# EAGLE design PGTNXEN_cv_out (EAGLE 8.5.2)
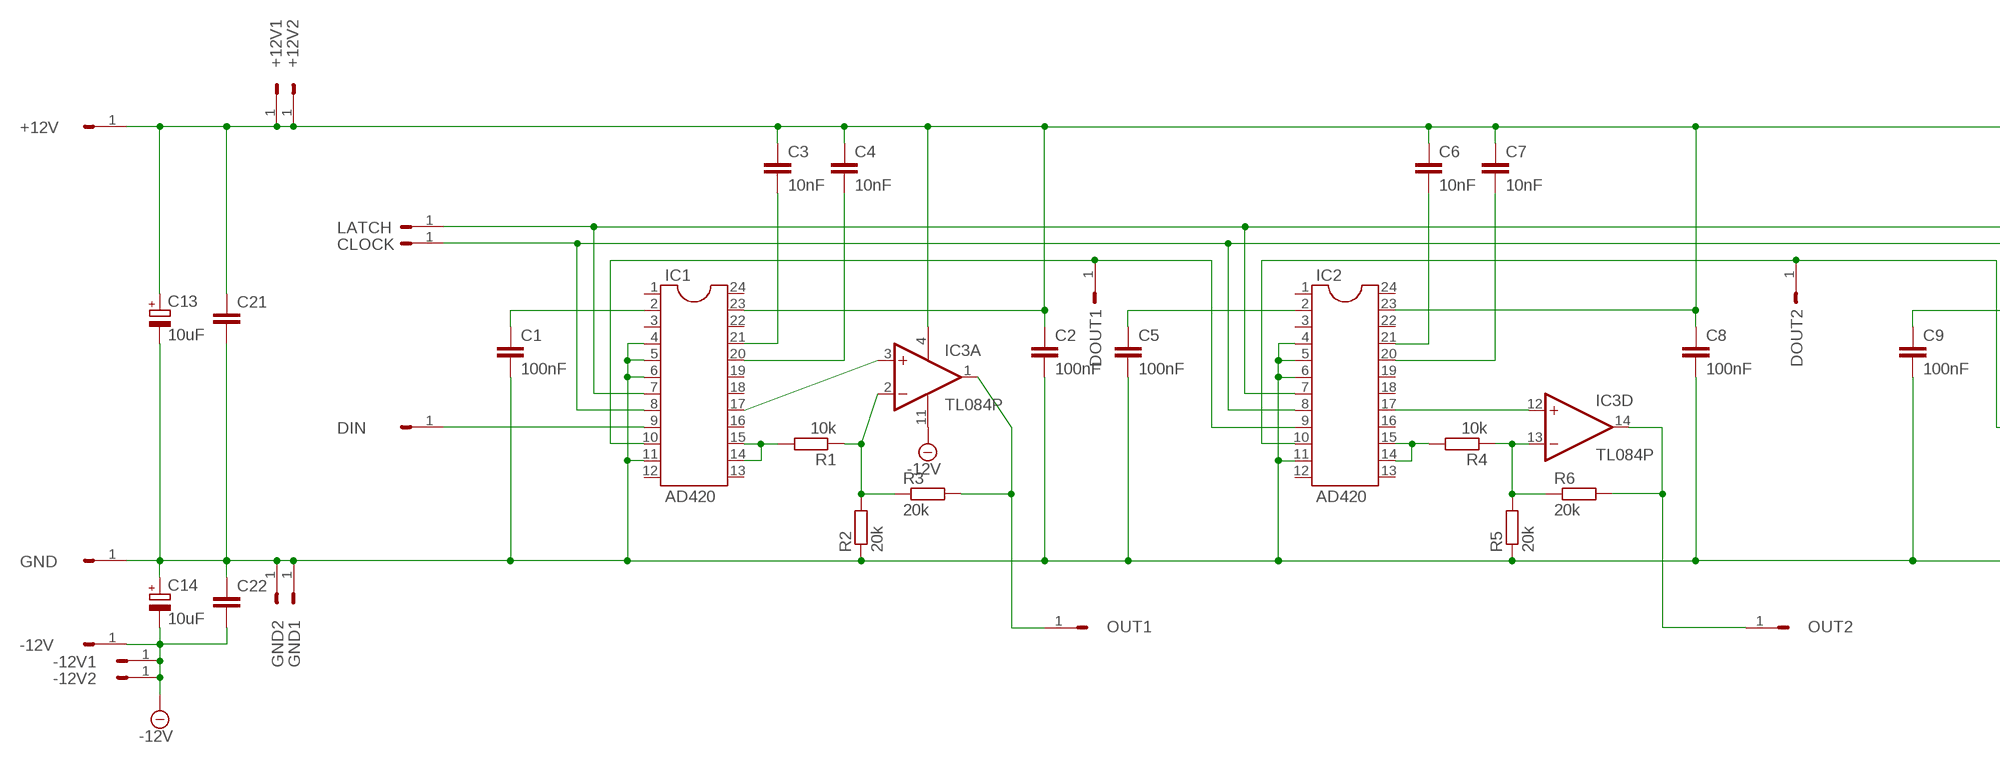
[diagram p0: schematic, sheet 1, part 1 of 2]
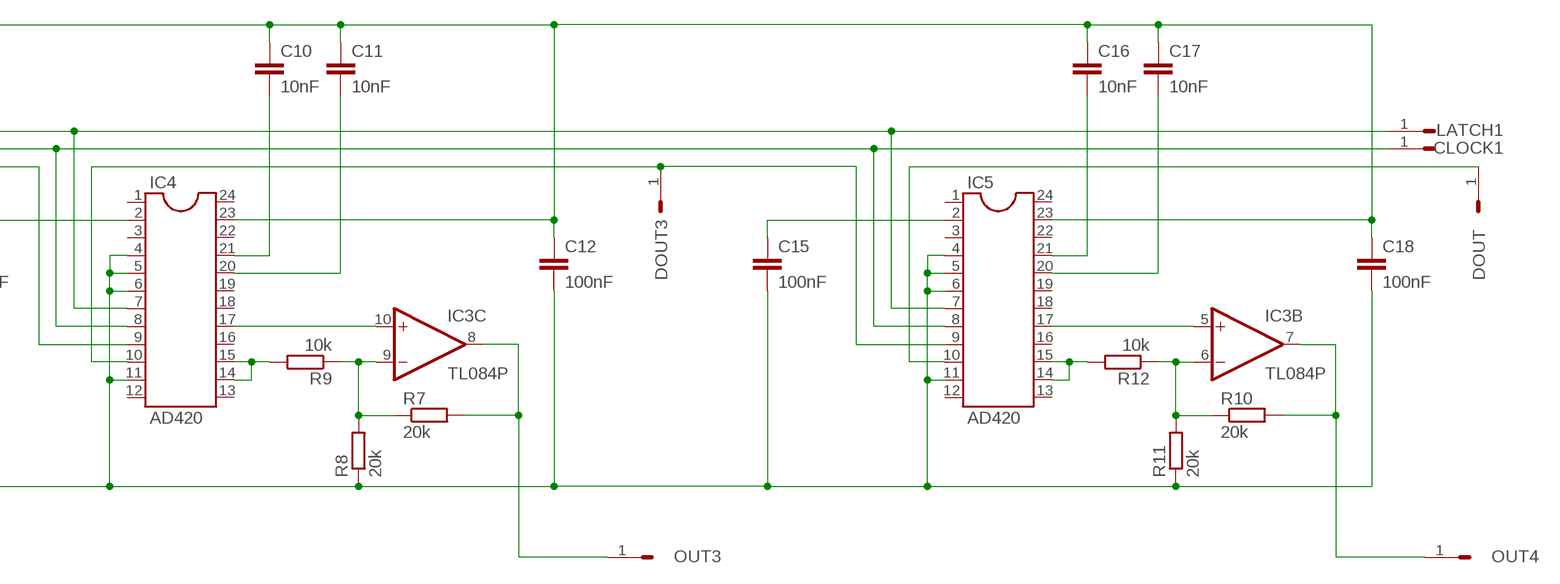
[diagram p1: schematic, sheet 1, part 2 of 2]

## Parts
+12V  HEADER/MALE/01  [HEADER/MALE/01]
+12V1  HEADER/MALE/01  [HEADER/MALE/01]
+12V2  HEADER/MALE/01  [HEADER/MALE/01]
-12V  HEADER/MALE/01  [HEADER/MALE/01]
-12V1  HEADER/MALE/01  [HEADER/MALE/01]
-12V2  HEADER/MALE/01  [HEADER/MALE/01]
C1  100nF  CAPACITORCERAMICDISC/5  [CERAMICDISC/5]
C2  100nF  CAPACITORCERAMICDISC/5  [CERAMICDISC/5]
C3  10nF  CAPACITORCERAMICDISC/5  [CERAMICDISC/5]
C4  10nF  CAPACITORCERAMICDISC/5  [CERAMICDISC/5]
C5  100nF  CAPACITORCERAMICDISC/5  [CERAMICDISC/5]
C6  10nF  CAPACITORCERAMICDISC/5  [CERAMICDISC/5]
C7  10nF  CAPACITORCERAMICDISC/5  [CERAMICDISC/5]
C8  100nF  CAPACITORCERAMICDISC/5  [CERAMICDISC/5]
C9  100nF  CAPACITORCERAMICDISC/5  [CERAMICDISC/5]
C10  10nF  CAPACITORCERAMICDISC/5  [CERAMICDISC/5]
C11  10nF  CAPACITORCERAMICDISC/5  [CERAMICDISC/5]
C12  100nF  CAPACITORCERAMICDISC/5  [CERAMICDISC/5]
C13  10uF  CAPACITOR/POLARIZEDE2.5-6  [E2,5-6]
C14  10uF  CAPACITOR/POLARIZEDE2.5-6  [E2,5-6]
C15  100nF  CAPACITORCERAMICDISC/5  [CERAMICDISC/5]
C16  10nF  CAPACITORCERAMICDISC/5  [CERAMICDISC/5]
C17  10nF  CAPACITORCERAMICDISC/5  [CERAMICDISC/5]
C18  100nF  CAPACITORCERAMICDISC/5  [CERAMICDISC/5]
C21  CAPACITORCERAMICDISC/5  [CERAMICDISC/5]
C22  CAPACITORCERAMICDISC/5  [CERAMICDISC/5]
CLOCK  HEADER/MALE/01  [HEADER/MALE/01]
CLOCK1  HEADER/MALE/01  [HEADER/MALE/01]
DIN  HEADER/MALE/01  [HEADER/MALE/01]
DOUT  HEADER/MALE/01  [HEADER/MALE/01]
DOUT1  HEADER/MALE/01  [HEADER/MALE/01]
DOUT2  HEADER/MALE/01  [HEADER/MALE/01]
DOUT3  HEADER/MALE/01  [HEADER/MALE/01]
GND  HEADER/MALE/01  [HEADER/MALE/01]
GND1  HEADER/MALE/01  [HEADER/MALE/01]
GND2  HEADER/MALE/01  [HEADER/MALE/01]
IC1  AD420  DIL24-3  [DIL24-3]
IC2  AD420  DIL24-3  [DIL24-3]
IC3  TL084P  [DIL14]
IC4  AD420  DIL24-3  [DIL24-3]
IC5  AD420  DIL24-3  [DIL24-3]
LATCH  HEADER/MALE/01  [HEADER/MALE/01]
LATCH1  HEADER/MALE/01  [HEADER/MALE/01]
OUT1  HEADER/MALE/01  [HEADER/MALE/01]
OUT2  HEADER/MALE/01  [HEADER/MALE/01]
OUT3  HEADER/MALE/01  [HEADER/MALE/01]
OUT4  HEADER/MALE/01  [HEADER/MALE/01]
R1  10k  R-EU_0204/7  [0204/7]
R2  20k  R-EU_0204/7  [0204/7]
R3  20k  R-EU_0204/7  [0204/7]
R4  10k  R-EU_0204/7  [0204/7]
R5  20k  R-EU_0204/7  [0204/7]
R6  20k  R-EU_0204/7  [0204/7]
R7  20k  R-EU_0204/7  [0204/7]
R8  20k  R-EU_0204/7  [0204/7]
R9  10k  R-EU_0204/7  [0204/7]
R10  20k  R-EU_0204/7  [0204/7]
R11  20k  R-EU_0204/7  [0204/7]
R12  10k  R-EU_0204/7  [0204/7]

## Nets
-12V: -12V1.1 -12V2.1 -12V.1 C14.- C22.2 IC3.11(P:V-)
GND: C1.2 C2.2 C5.2 C8.2 C9.2 C12.2 C13.- C14.+ C15.2 C18.2 C21.2 C22.1 GND1.1 GND2.1 GND.1 IC1.4 IC1.5 IC1.6 IC1.11 IC2.4 IC2.5 IC2.6 IC2.11 IC4.4 IC4.5 IC4.6 IC4.11 IC5.4 IC5.5 IC5.6 IC5.11 R2.1 R5.1 R8.1 R11.1
N$1: CLOCK1.1 CLOCK.1 IC1.8 IC2.8 IC4.8 IC5.8
N$2: IC2.17 IC3.12(D:+IN)
N$3: DIN.1 IC1.9
N$4: IC2.14 IC2.15 R4.2
N$5: DOUT.1 IC5.10
N$6: IC3.2(A:-IN) R1.1 R2.2 R3.1
N$7: +12V1.1 +12V2.1 +12V.1 C2.1 C3.1 C4.1 C6.1 C7.1 C8.1 C10.1 C11.1 C12.1 C13.+ C16.1 C17.1 C18.1 C21.1 IC1.23 IC2.23 IC3.4(P:V+) IC4.23 IC5.23
N$8: C1.1 IC1.2
N$9: C3.2 IC1.21
N$10: C4.2 IC1.20
N$11: IC1.17 IC3.3(A:+IN)
N$12: IC1.14 IC1.15 R1.2
N$13: IC3.1(A:OUT) OUT1.1 R3.2
N$14: IC3.5(B:+IN) IC5.17
N$15: DOUT1.1 IC1.10 IC2.9
N$17: IC3.14(D:OUT) OUT2.1 R6.2
N$19: C5.1 IC2.2
N$20: C6.2 IC2.21
N$21: C7.2 IC2.20
N$22: IC3.13(D:-IN) R4.1 R5.2 R6.1
N$23: DOUT3.1 IC4.10 IC5.9
N$24: DOUT2.1 IC2.10 IC4.9
N$25: IC4.14 IC4.15 R9.2
N$26: IC3.10(C:+IN) IC4.17
N$27: IC3.8(C:OUT) OUT3.1 R7.2
N$28: C9.1 IC4.2
N$29: C10.2 IC4.21
N$30: C11.2 IC4.20
N$32: IC5.14 IC5.15 R12.2
N$33: IC3.9(C:-IN) R7.1 R8.2 R9.1
N$35: IC3.7(B:OUT) OUT4.1 R10.2
N$36: C15.1 IC5.2
N$37: C16.2 IC5.21
N$38: C17.2 IC5.20
N$39: IC1.7 IC2.7 IC4.7 IC5.7 LATCH1.1 LATCH.1
N$40: IC3.6(B:-IN) R10.1 R11.2 R12.1
Unconnected: IC1.1 IC1.3 IC1.12 IC1.13 IC1.16 IC1.18 IC1.19 IC1.22 IC1.24 IC2.1 IC2.3 IC2.12 IC2.13 IC2.16 IC2.18 IC2.19 IC2.22 IC2.24 IC4.1 IC4.3 IC4.12 IC4.13 IC4.16 IC4.18 IC4.19 IC4.22 IC4.24 IC5.1 IC5.3 IC5.12 IC5.13 IC5.16 IC5.18 IC5.19 IC5.22 IC5.24

## Library data of the parts
+12V +12V1 +12V2 -12V -12V1 -12V2 CLOCK CLOCK1 DIN DOUT DOUT1-DOUT3 GND GND1 GND2 LATCH LATCH1 OUT1-OUT4 = connectors:HEADER/MALE/01
C1-C12 C15-C18 C21 C22 = capacitors:CAPACITOR: CAPACITOR, European symbol
C13 C14 = capacitors:CAPACITOR/POLARIZED: POLARIZED CAPACITOR, European symbol
IC1 IC2 IC4 IC5 = ic-package:DIL24: Dual In Line
IC3 = ic_analogue:TL084: OP AMP
R1-R12 = rcl:R-EU_: RESISTOR, European symbol

## Board
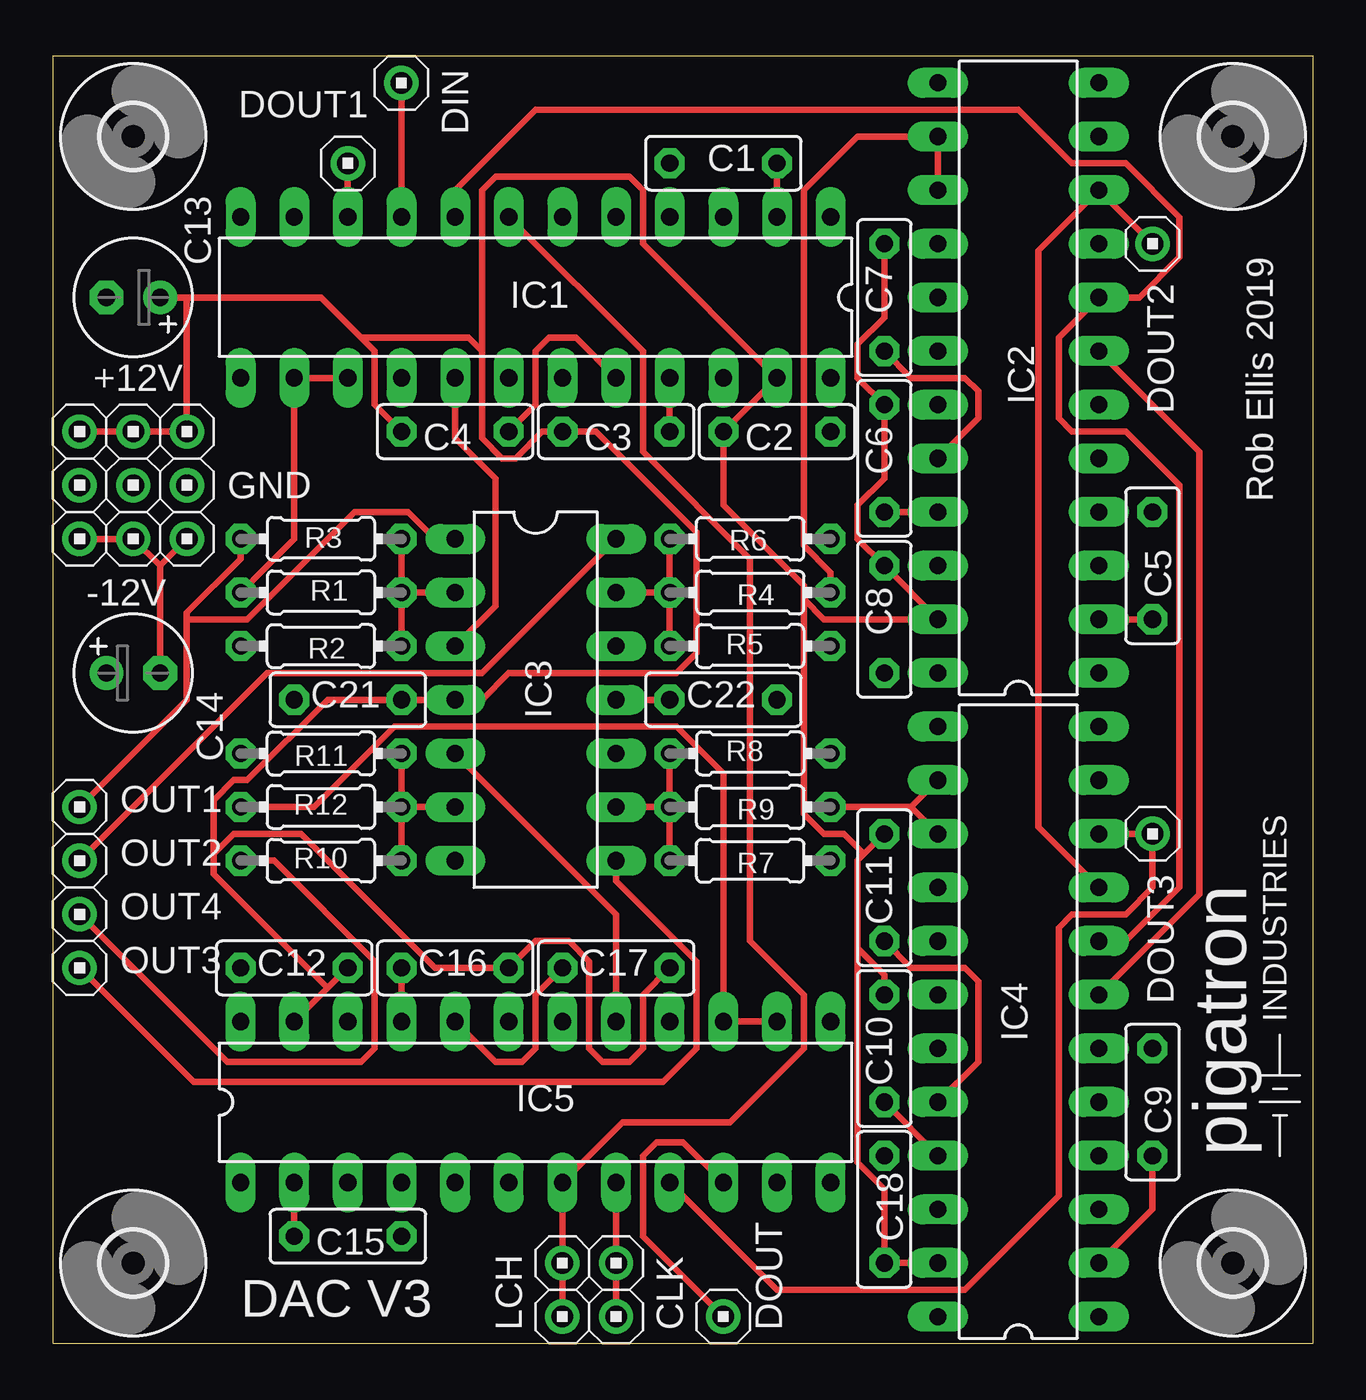
[diagram p2: board, top side]
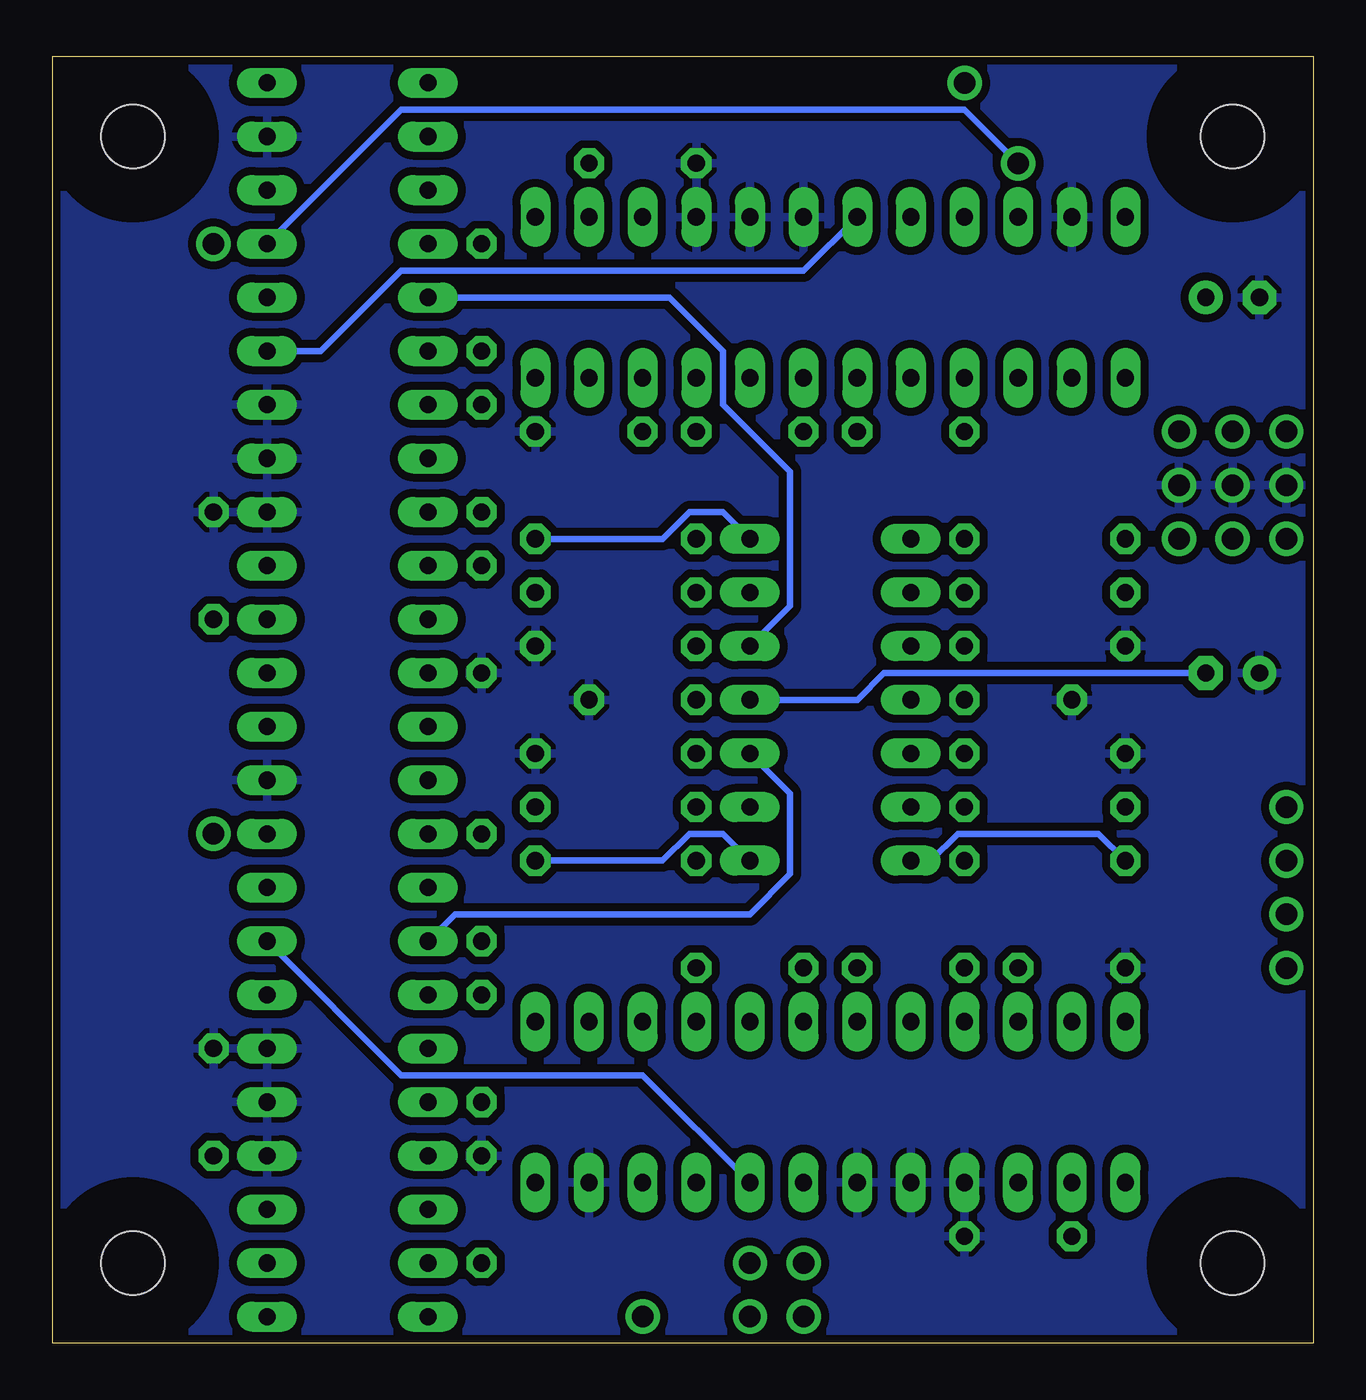
[diagram p3: board, bottom side, seen from below]

Size 59.68 x 60.95 mm. Coordinates in mm from the lower left corner, seen from the top.
Outline: 0,0 59.68,0 59.68,60.95 0,60.95 0,0
Copper layers (1*16): Top 0.0356mm / dielectric 1.5011mm / Bottom 0.0356mm
Design rules "LaenPCBOrder": minimum track width 12mil, minimum drill 13mil, track to track 15mil, track to pad 10mil, pad to pad 10mil, via to via 10mil, smd to smd 6mil, copper to edge 15mil, drill to drill 10mil, minimum pad ring 12mil, minimum via ring 10mil, stop-mask expansion 4mil, vias tented up to drill 0mil, thermal gap 10mil

### Footprints (pad centres in the part's own frame; a part is rotated, then mirrored left to right if it is on the bottom)
HEADER/MALE/01 = drill 1.016: 1 0,0
CERAMICDISC/5 = drill 0.813 octagon: 1 -2.54,0; 2 2.54,0
E2,5-6 = drill 0.813 pad 1.6: + -1.27,0 | drill 0.813 pad 1.6 octagon: - 1.27,0
DIL24-3 = drill 0.813 long: 1 -13.97,-3.81; 2 -11.43,-3.81; 3 -8.89,-3.81; 4 -6.35,-3.81; 5 -3.81,-3.81; 6 -1.27,-3.81; 7 1.27,-3.81; 8 3.81,-3.81; 9 6.35,-3.81; 10 8.89,-3.81; 11 11.43,-3.81; 12 13.97,-3.81; 13 13.97,3.81; 14 11.43,3.81; 15 8.89,3.81; 16 6.35,3.81; 17 3.81,3.81; 18 1.27,3.81; 19 -1.27,3.81; 20 -3.81,3.81; 21 -6.35,3.81; 22 -8.89,3.81; 23 -11.43,3.81; 24 -13.97,3.81
DIL14 = drill 0.813 long: 1 -7.62,-3.81; 2 -5.08,-3.81; 3 -2.54,-3.81; 4 0,-3.81; 5 2.54,-3.81; 6 5.08,-3.81; 7 7.62,-3.81; 8 7.62,3.81; 9 5.08,3.81; 10 2.54,3.81; 11 0,3.81; 12 -2.54,3.81; 13 -5.08,3.81; 14 -7.62,3.81
0204/7 = drill 0.813 octagon: 1 -3.81,0; 2 3.81,0
3,0 = hole 3: 0,0

### Placement (x,y rotation side)
+12V  1.27,43.18 0 top
+12V1  6.35,43.18 0 top
+12V2  3.81,43.18 0 top
-12V  6.35,38.1 0 top
-12V1  3.81,38.1 0 top
-12V2  1.27,38.1 0 top
C1  31.75,55.88 180 top
C2  34.29,43.18 0 top
C3  26.67,43.18 0 top
C4  19.05,43.18 0 top
C5  52.07,36.83 90 top
C6  39.37,41.91 270 top
C7  39.37,49.53 270 top
C8  39.37,34.29 270 top
C9  52.07,11.43 90 top
C10  39.37,13.97 270 top
C11  39.37,21.59 270 top
C12  11.43,17.78 180 top
C13  3.81,49.53 180 top
C14  3.81,31.75 0 top
C15  13.97,5.08 0 top
C16  19.05,17.78 180 top
C17  26.67,17.78 180 top
C18  39.37,6.35 90 top
C21  13.97,30.48 180 top
C22  31.75,30.48 180 top
CLOCK  26.67,1.27 90 top
CLOCK1  26.67,3.81 90 top
DIN  16.51,59.69 90 top
DOUT  31.75,1.27 90 top
DOUT1  13.97,55.88 180 top
DOUT2  52.07,52.07 270 top
DOUT3  52.07,24.13 270 top
GND  6.35,40.64 0 top
GND1  3.81,40.64 0 top
GND2  1.27,40.64 0 top
IC1  22.86,49.53 180 top
IC2  45.72,45.72 90 top
IC3  22.86,30.48 270 top
IC4  45.72,15.24 90 top
IC5  22.86,11.43 0 top
LATCH  24.13,1.27 90 top
LATCH1  24.13,3.81 90 top
OUT1  1.27,25.4 0 top
OUT2  1.27,22.86 0 top
OUT3  1.27,17.78 0 top
OUT4  1.27,20.32 0 top
R1  12.7,35.56 180 top
R2  12.7,33.02 0 top
R3  12.7,38.1 180 top
R4  33.02,35.56 0 top
R5  33.02,33.02 180 top
R6  33.02,38.1 0 top
R7  33.02,22.86 0 top
R8  33.02,27.94 180 top
R9  33.02,25.4 0 top
R10  12.7,22.86 180 top
R11  12.7,27.94 0 top
R12  12.7,25.4 180 top
U$1  [3,0]  3.81,57.15 0 top
U$2  [3,0]  3.81,3.81 0 top
U$3  [3,0]  55.88,3.81 0 top
U$4  [3,0]  55.88,57.15 0 top
U$5  [PIGATRON-LOGO]  56.52,17.78 90 top

### Tracks (layer width: path | path; a pad name or v marks a point on that pad's centre or on a via)
-12V
  Top 0.305: C22.2 IC3.11 | 5.08,36.83 C14.- | 5.08,36.83 -12V1.1 -12V2.1 | 5.08,36.83 -12V.1
  Bottom 0.305: IC3.11 21.59,30.48 20.32,31.75 C14.-
GND
  pour Bottom: 0,60.96 0,0 59.69,0 59.69,60.96
N$1
  Top 0.305: IC4.8 50.8,19.05 53.34,21.59 53.34,40.64 50.8,43.18 48.26,43.18 47.62,43.81 47.62,47.62 IC2.8 51.43,49.53 53.34,51.43 53.34,53.34 50.8,55.88 48.26,55.88 45.72,58.42 22.86,58.42 19.05,54.61 IC1.8 | IC5.8 CLOCK1.1 CLOCK.1
  Bottom 0.305: IC5.8 31.75,12.7 43.18,12.7 IC4.8
N$2
  Bottom 0.305: IC3.12 24.77,34.92 24.77,41.27 27.94,44.45 27.94,46.99 30.48,49.53 IC2.17
N$3
  Top 0.305: DIN.1 IC1.9
N$4
  Top 0.305: R4.2 36.83,36.51 35.56,37.78 35.56,54.61 38.1,57.15 IC2.14 IC2.15
N$5
  Top 0.305: IC5.10 29.85,9.53 28.57,9.53 27.94,8.89 27.94,5.08 DOUT.1
N$6
  Top 0.305: R1.1 R2.2 | R1.1 IC3.2 | R1.1 R3.1
N$7
  Top 0.305: IC4.23 C18.1 39.37,7.3 38.1,8.57 38.1,18.73 | C10.1 39.37,17.46 38.1,18.73 | 38.1,18.73 38.1,22.86 38.42,23.18 | C11.1 38.42,23.18 | C7.1 39.37,48.58 38.1,47.31 38.1,45.72 C6.1 39.37,40.96 38.1,39.69 38.1,38.1 C8.1 IC2.23 36.51,34.29 35.56,35.24 | 35.56,35.24 35.56,35.88 31.75,39.69 C2.1 IC1.23 27.94,52.07 27.94,54.61 27.3,55.24 20.96,55.24 20.32,54.61 20.32,46.99 | 38.42,23.18 37.46,24.13 36.51,24.13 35.56,25.08 35.56,35.24 | +12V.1 +12V2.1 +12V1.1 6.35,49.53 | C4.1 15.24,44.45 15.24,46.99 14.6,47.62 | 14.6,47.62 12.7,49.53 6.35,49.53 | C13.+ 6.35,49.53 | 20.32,46.99 20.32,42.86 21.27,41.91 21.91,41.91 23.18,43.18 C3.1 25.72,43.18 30.48,38.42 30.48,32.7 29.53,31.75 21.59,31.75 20.32,30.48 IC3.4 C21.1 13.02,30.48 9.21,26.67 8.57,26.67 7.62,25.72 7.62,23.18 | 20.32,46.99 19.69,47.62 14.6,47.62 | C12.1 13.02,16.83 | 13.02,16.83 IC5.23 | 7.62,23.18 8.57,24.13 11.75,24.13 18.1,17.78 C16.1 22.86,19.05 24.45,19.05 25.4,18.1 25.4,13.97 26.04,13.33 27.3,13.33 27.94,13.97 27.94,16.51 C17.1 | 7.62,23.18 7.62,22.23 13.02,16.83
N$8
  Top 0.305: C1.1 IC1.2
N$9
  Top 0.305: IC1.21 C3.2
N$10
  Top 0.305: C4.2 22.86,44.45 22.86,46.99 23.5,47.62 24.77,47.62 IC1.20
N$11
  Top 0.305: IC3.3 20.96,34.92 20.96,40.96 19.05,42.86 IC1.17
N$12
  Top 0.305: R1.2 11.43,38.1 IC1.14 IC1.15
N$13
  Top 0.305: R3.2 8.89,37.15 6.35,34.61 6.35,34.29 | 6.35,34.29 6.35,30.48 OUT1.1 | IC3.1 18.1,38.1 16.83,39.37 14.29,39.37 9.21,34.29 6.35,34.29
N$14
  Top 0.305: IC3.5 26.67,20.32 IC5.17
N$15
  Top 0.305: DOUT1.1 IC1.10
  Bottom 0.305: IC2.9 43.18,58.42 16.51,58.42 DOUT1.1
N$17
  Top 0.305: IC3.14 20.32,31.75 10.16,31.75 OUT2.1
  Bottom 0.305: R6.2 30.8,38.1 29.53,39.37 27.94,39.37 IC3.14
N$19
  Top 0.305: C5.1 IC2.2
N$20
  Top 0.305: IC2.21 C6.2
N$21
  Top 0.305: IC2.20 43.81,43.81 43.81,45.09 43.18,45.72 40.64,45.72 C7.2
N$22
  Top 0.305: R4.1 IC3.13 | R4.1 R5.2 | R4.1 R6.1
N$23
  Top 0.305: IC5.9 34.29,2.54 43.18,2.54 47.62,6.98 47.62,19.69 48.26,20.32 50.8,20.32 52.07,21.59 DOUT3.1 IC4.10
N$24
  Top 0.305: IC4.9 46.67,24.45 46.67,51.75 IC2.10 DOUT2.1
N$25
  Top 0.305: 40.64,25.4 R9.2 | IC4.14 40.64,25.4 | 40.64,25.4 IC4.15
N$26
  Bottom 0.305: IC3.10 24.77,26.04 24.77,22.23 26.67,20.32 40.64,20.32 IC4.17
N$27
  Top 0.305: IC3.8 26.67,21.91 30.48,18.1 30.48,13.97 28.89,12.38 6.67,12.38 OUT3.1
  Bottom 0.305: R7.2 30.8,22.86 29.53,24.13 27.94,24.13 IC3.8
N$28
  Top 0.305: IC4.2 52.07,6.35 C9.1
N$29
  Top 0.305: IC4.21 C10.2
N$30
  Top 0.305: IC4.20 43.81,13.33 43.81,17.14 43.18,17.78 40.64,17.78 C11.2
N$32
  Top 0.305: IC5.14 IC5.15 31.75,26.99 29.53,29.21 16.19,29.21 12.38,25.4 R12.2
N$33
  Top 0.305: R9.1 IC3.9 | R9.1 R7.1 | R9.1 R8.2
N$35
  Top 0.305: R10.2 10.48,22.86 15.24,18.1 15.24,13.97 14.6,13.33 8.25,13.33 OUT4.1
  Bottom 0.305: IC3.7 18.1,22.86 16.83,24.13 10.16,24.13 R10.2
N$36
  Top 0.305: IC5.2 C15.1
N$37
  Top 0.305: C16.2 IC5.21
N$38
  Top 0.305: IC5.20 20.96,13.33 22.23,13.33 22.86,13.97 22.86,16.51 C17.2
N$39
  Top 0.305: IC1.7 27.94,46.99 27.94,42.23 33.02,37.15 33.02,19.05 35.56,16.51 35.56,13.97 32.07,10.48 26.99,10.48 IC5.7 LATCH1.1 LATCH.1 | IC4.7 54.29,21.27 54.29,42.23 IC2.7
  Bottom 0.305: IC2.7 46.99,46.99 43.18,50.8 24.13,50.8 IC1.7
N$40
  Top 0.305: R12.1 R10.1 | R12.1 IC3.6 | R12.1 R11.2

### Text on the board
tNames: DIN | Rob Ellis 2019 | +12V | GND | -12V | DAC V3 | LCH | CLK